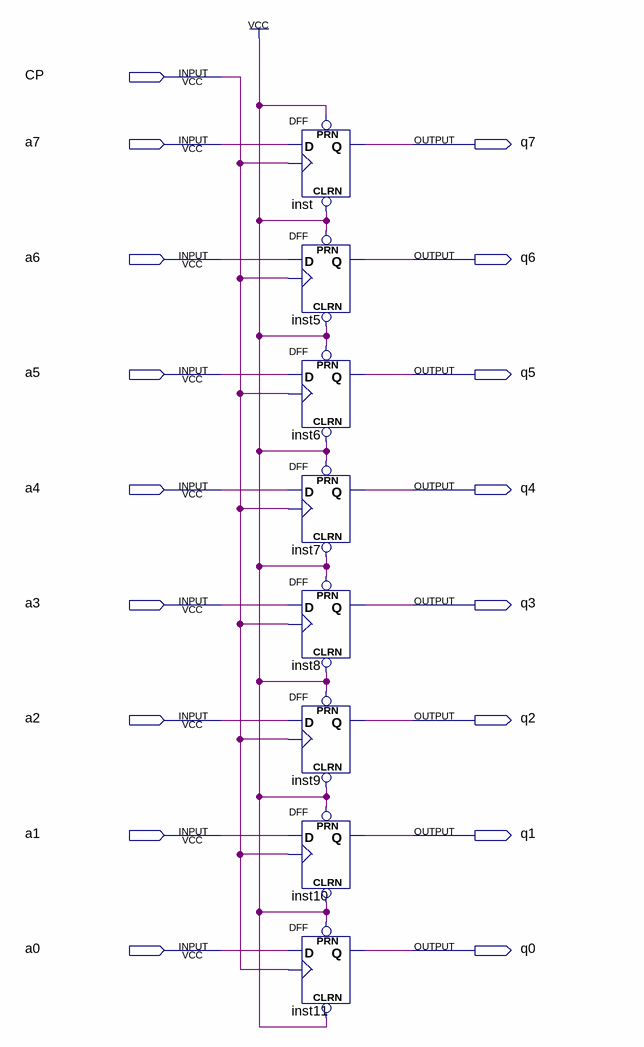
[diagram p0: schematic sheet]
// Quartus schematic Register8.bdf as structural Verilog: 8 symbols, 17 pins
module Register8 (
  input  CP,
  input  a7,
  input  a6,
  input  a5,
  input  a4,
  input  a3,
  input  a2,
  input  a1,
  input  a0,
  output q7,
  output q6,
  output q5,
  output q4,
  output q3,
  output q2,
  output q1,
  output q0
);

  DFF inst (.CLRN(1'b1), .CLK(CP), .D(a7), .PRN(1'b1), .Q(q7));
  DFF inst5 (.CLRN(1'b1), .CLK(CP), .D(a6), .PRN(1'b1), .Q(q6));
  DFF inst6 (.CLRN(1'b1), .CLK(CP), .D(a5), .PRN(1'b1), .Q(q5));
  DFF inst7 (.CLRN(1'b1), .CLK(CP), .D(a4), .PRN(1'b1), .Q(q4));
  DFF inst8 (.CLRN(1'b1), .CLK(CP), .D(a3), .PRN(1'b1), .Q(q3));
  DFF inst9 (.CLRN(1'b1), .CLK(CP), .D(a2), .PRN(1'b1), .Q(q2));
  DFF inst10 (.CLRN(1'b1), .CLK(CP), .D(a1), .PRN(1'b1), .Q(q1));
  DFF inst11 (.CLRN(1'b1), .CLK(CP), .D(a0), .PRN(1'b1), .Q(q0));
endmodule
